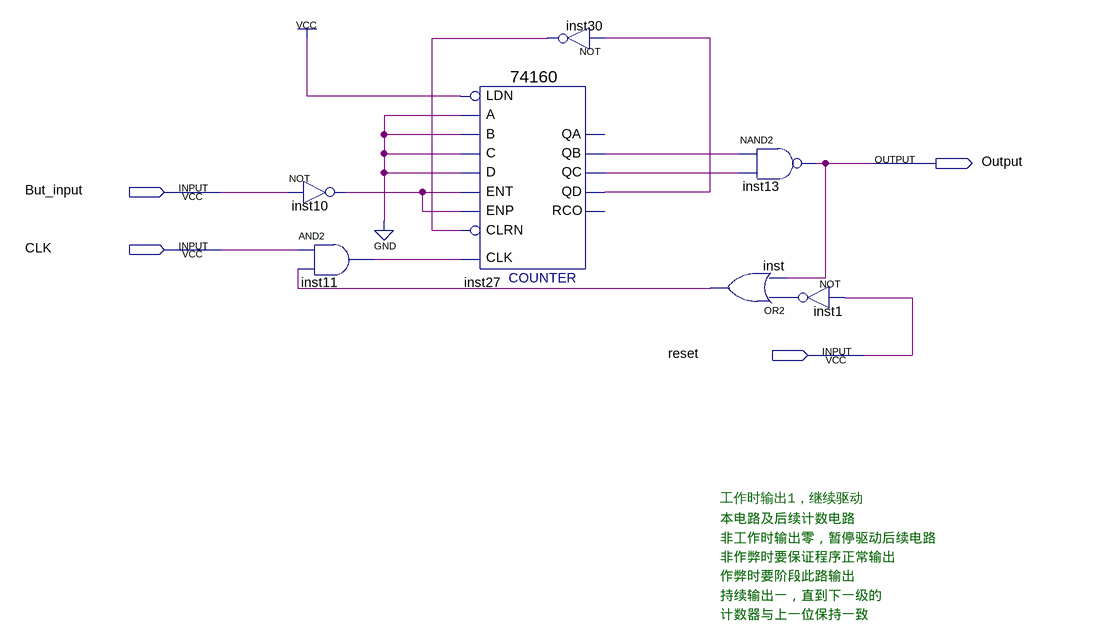
[diagram p0: schematic sheet]
// Quartus schematic delay_button.bdf as structural Verilog: 7 symbols, 4 pins
module delay_button (
  input  But_input,
  input  CLK,
  input  reset,
  output Output
);

  wire inst1_out, inst10_out, inst11_out, inst27_qb, inst27_qc, inst27_qd, inst30_out, inst_out;

  not inst10 (inst10_out, But_input);
  and inst11 (inst11_out, CLK, inst_out);
  \74160  inst27 (
    .CLK(inst11_out), .ENT(inst10_out), .A(1'b0), .B(1'b0), .C(1'b0), .D(1'b0), .LDN(1'b1), .ENP(inst10_out),
    .CLRN(inst30_out), .QD(inst27_qd), .QB(inst27_qb), .QC(inst27_qc));  // open: QA, RCO
  not inst30 (inst30_out, inst27_qd);
  nand inst13 (Output, inst27_qb, inst27_qc);
  or inst (inst_out, inst1_out, Output);
  not inst1 (inst1_out, reset);

  // Notes on the sheet:
  //   工作时输出1，继续驱动
  //   本电路及后续计数电路
  //   非工作时输出零，暂停驱动后续电路
  //   非作弊时要保证程序正常输出
  //   作弊时要阶段此路输出
  //   持续输出一，直到下一级的
  //   计数器与上一位保持一致
endmodule
